# EAGLE design hawb-board (EAGLE 6.4)

## Sheet 1 of 2
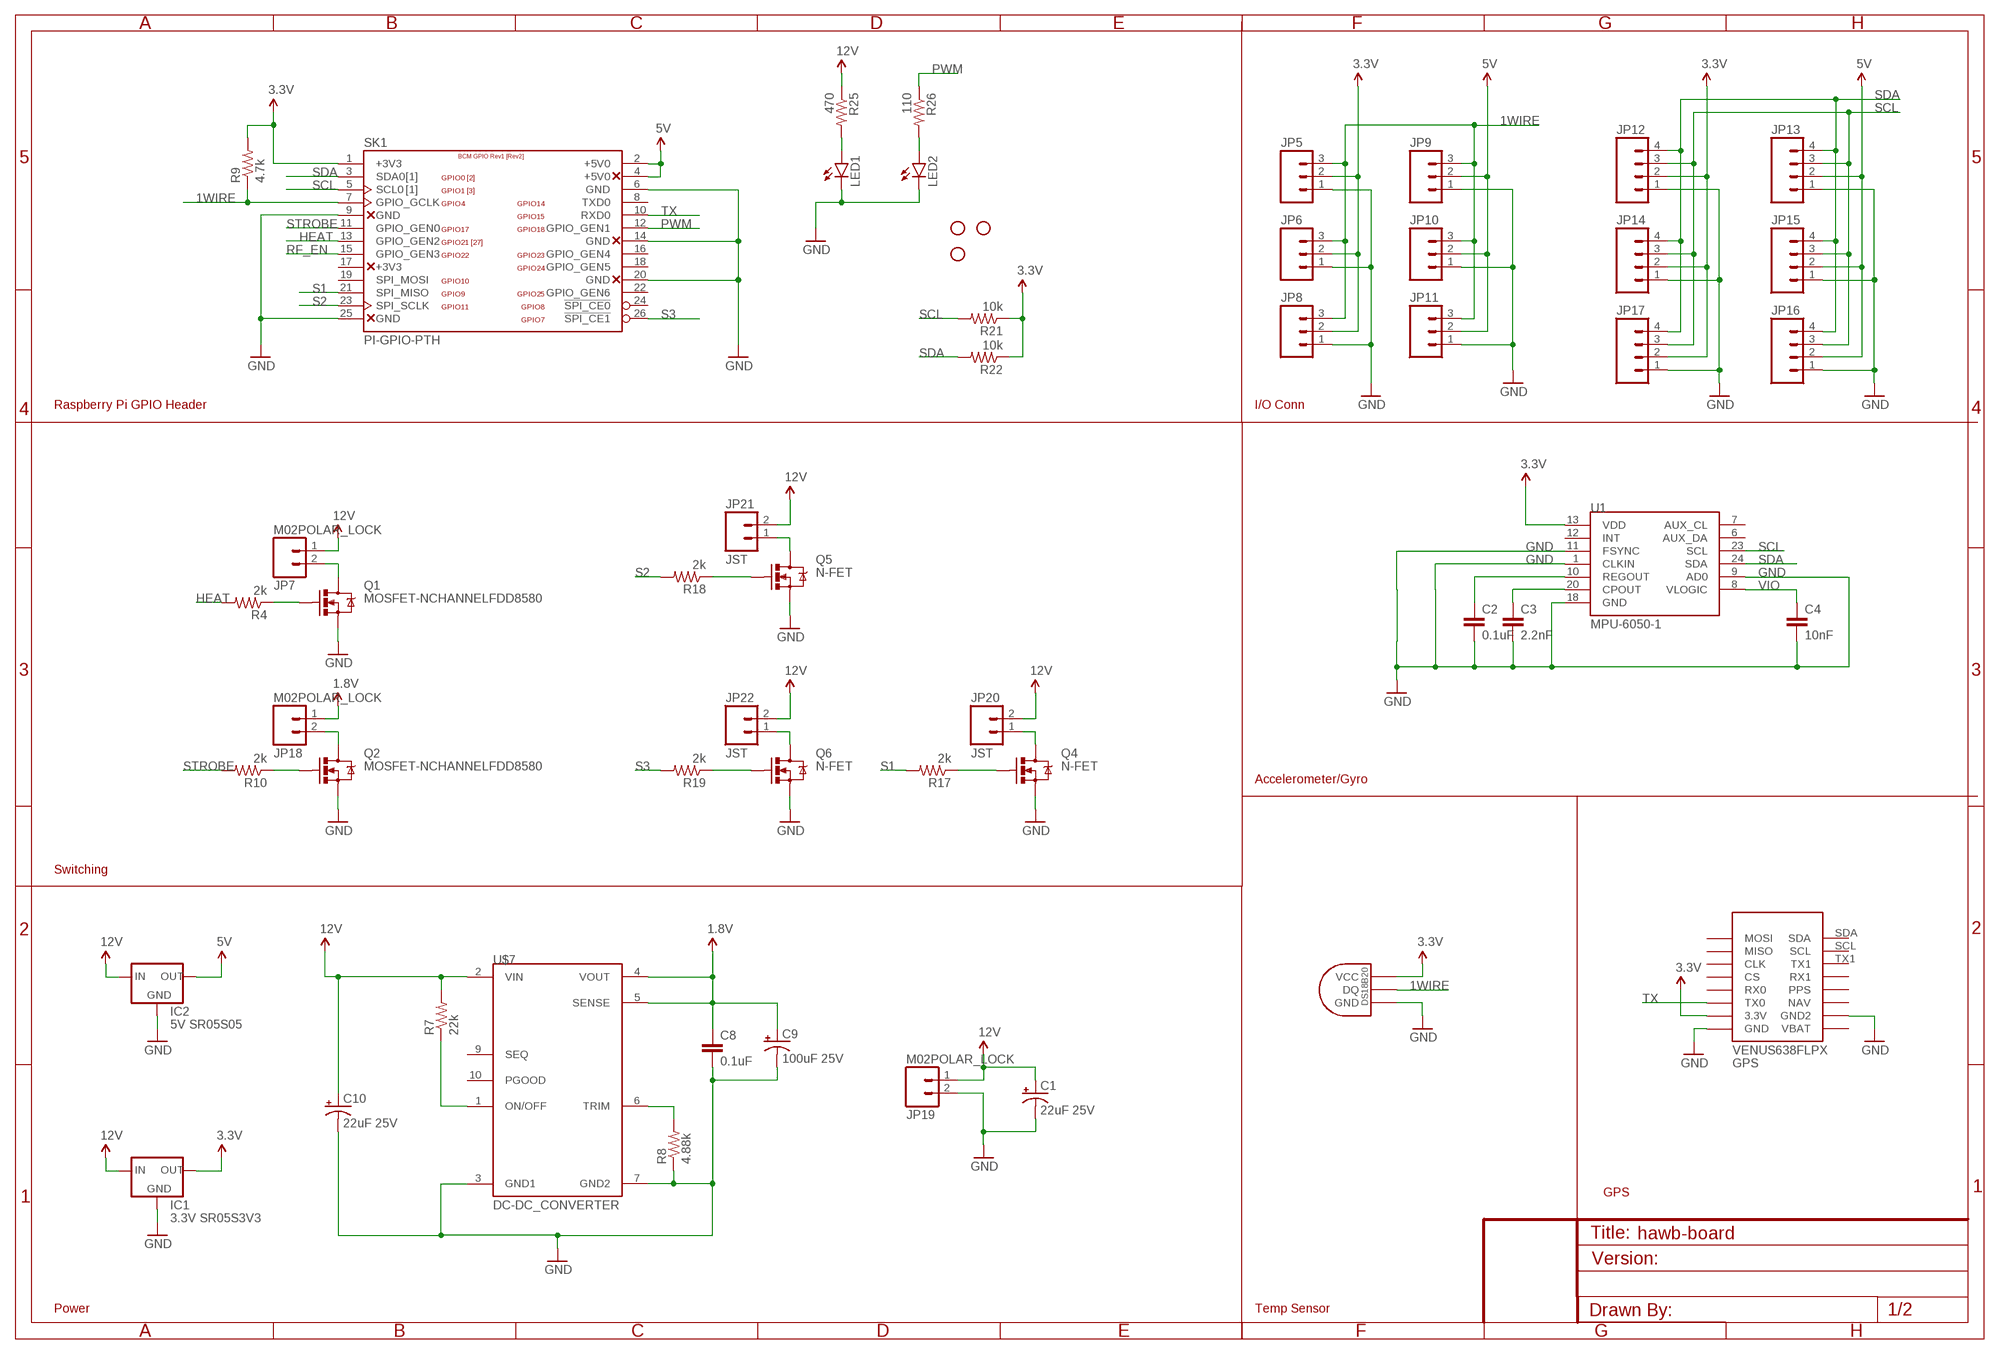
[diagram p0: schematic, sheet 1]

### Parts
C1  22uF 25V  CAP_POLC  [PANASONIC_C]
C2  0.1uF  CAP0402-CAP  [0402-CAP]
C3  2.2nF  CAP0402-CAP  [0402-CAP]
C4  10nF  CAP0402-CAP  [0402-CAP]
C8  0.1uF  C-EUC0603  [C0603]
C9  100uF 25V  CAP_POLF80  [NIPPON_F80]
C10  22uF 25V  CAP_POLC  [PANASONIC_C]
GPS  VENUS638FLPX  [VENUS638FLPX]
IC1  3.3V SR05S3V3  78XXS  [78XXS]
IC2  5V SR05S05  78XXS  [78XXS]
JP1  STAND-OFF  [STAND-OFF]
JP2  STAND-OFF  [STAND-OFF]
JP4  STAND-OFF  [STAND-OFF]
JP5  M03JST-PTH-VERT  [JST-3-PTH-VERT]
JP6  M03JST-PTH-VERT  [JST-3-PTH-VERT]
JP7  M02POLAR_LOCK  [MOLEX-1X2_LOCK]
JP8  M03JST-PTH-VERT  [JST-3-PTH-VERT]
JP9  M03JST-PTH-VERT  [JST-3-PTH-VERT]
JP10  M03JST-PTH-VERT  [JST-3-PTH-VERT]
JP11  M03JST-PTH-VERT  [JST-3-PTH-VERT]
JP12  M04JST-PTH-VERT  [JST-4-PTH-VERT]
JP13  M04JST-PTH-VERT  [JST-4-PTH-VERT]
JP14  M04JST-PTH-VERT  [JST-4-PTH-VERT]
JP15  M04JST-PTH-VERT  [JST-4-PTH-VERT]
JP16  M04JST-PTH-VERT  [JST-4-PTH-VERT]
JP17  M04JST-PTH-VERT  [JST-4-PTH-VERT]
JP18  M02POLAR_LOCK  [MOLEX-1X2_LOCK]
JP19  M02POLAR_LOCK  [MOLEX-1X2_LOCK]
JP20  JST  M02JST-PTH-VERT  [JST-2-PTH-VERT]
JP21  JST  M02JST-PTH-VERT  [JST-2-PTH-VERT]
JP22  JST  M02JST-PTH-VERT  [JST-2-PTH-VERT]
LED1  LED1206  [LED-1206]
LED2  LED1206  [LED-1206]
Q1  MOSFET-NCHANNELFDD8580  [DPAK]
Q2  MOSFET-NCHANNELFDD8580  [DPAK]
Q4  N-FET  MOSFET-NCHANNELSMD  [SOT23-3]
Q5  N-FET  MOSFET-NCHANNELSMD  [SOT23-3]
Q6  N-FET  MOSFET-NCHANNELSMD  [SOT23-3]
R4  2k  RESISTOR0603-RES  [0603-RES]
R7  22k  RESISTOR0603-RES  [0603-RES]
R8  4.88k  RESISTOR0603-RES  [0603-RES]
R9  4.7k  RESISTOR0603-RES  [0603-RES]
R10  2k  RESISTOR0603-RES  [0603-RES]
R17  2k  RESISTOR0603-RES  [0603-RES]
R18  2k  RESISTOR0603-RES  [0603-RES]
R19  2k  RESISTOR0603-RES  [0603-RES]
R21  10k  RESISTOR0603-RES  [0603-RES]
R22  10k  RESISTOR0603-RES  [0603-RES]
R25  470  RESISTOR0603-RES  [0603-RES]
R26  110  RESISTOR0603-RES  [0603-RES]
SK1  PI-GPIO-PTH  [GPIO-CONNECTOR]
U1  MPU-6050-1  [QFN-24-4MM2]
U$4  DS1820SOIC  [DS18B20_SOIC]
U$7  DC-DC_CONVERTER  [DC-DC_CONVERTER]

### Nets
1.8V: C8.1 C9.+ JP18.1 U$7.4(VOUT) U$7.5(SENSE)
1WIRE: JP5.3 JP6.3 JP8.3 JP9.3 JP10.3 JP11.3 R9.1 SK1.7(GPIO_GCLK) U$4.DQ
3.3V: GPS.3.3V IC1.OUT JP5.2 JP6.2 JP8.2 JP12.2 JP14.2 JP17.2 R9.2 R21.1 R22.1 SK1.1(+3V3) U1.13(VDD) U$4.VCC ; also sheet 2
5V: IC2.OUT JP9.2 JP10.2 JP11.2 JP13.2 JP15.2 JP16.2 SK1.2(+5V0) SK1.4(+5V0) ; also sheet 2
GND: C1.- C2.2 C3.2 C4.2 C8.2 C9.- C10.- GPS.GND GPS.GND2 IC1.GND IC2.GND JP5.1 JP6.1 JP8.1 JP9.1 JP10.1 JP11.1 JP12.1 JP13.1 JP14.1 JP15.1 JP16.1 JP17.1 JP19.2 LED1.C LED2.C Q1.3(S) Q2.3(S) Q4.2(S) Q5.2(S) Q6.2(S) R8.1 SK1.6(GND) SK1.9(GND) SK1.14(GND) SK1.20(GND) SK1.25(GND) U1.1(CLKIN) U1.9(AD0) U1.11(FSYNC) U1.18(GND) U$4.GND U$7.3(GND1) U$7.7(GND2) ; also sheet 2
HEAT: R4.2 SK1.13(GPIO_GEN2)
N$3: JP7.2 Q1.4(D)
N$5: C3.1 U1.20(CPOUT)
N$6: Q1.1(G) R4.1
N$7: R8.2 U$7.6(TRIM)
N$8: R7.1 U$7.1(ON/OFF)
N$9: C2.1 U1.10(REGOUT)
N$10: JP18.2 Q2.4(D)
N$12: Q2.1(G) R10.1
N$15: JP20.1 Q4.3(D)
N$19: Q4.1(G) R17.1
N$21: JP21.1 Q5.3(D)
N$22: Q5.1(G) R18.1
N$23: JP22.1 Q6.3(D)
N$24: Q6.1(G) R19.1
N$27: LED1.A R25.2
N$28: LED2.A R26.2
PWM: R26.1 SK1.12(GPIO_GEN1)
RF_EN: SK1.15(GPIO_GEN3) ; also sheet 2
S1: R17.2 SK1.21(SPI_MISO)
S2: R18.2 SK1.23(SPI_SCLK)
S3: R19.2 SK1.26(!SPI_CE1)
SCL: JP12.3 JP13.3 JP14.3 JP15.3 JP16.3 JP17.3 R21.2 SK1.5(SCL0) U1.23(SCL) ; also sheet 2
SDA: JP12.4 JP13.4 JP14.4 JP15.4 JP16.4 JP17.4 R22.2 SK1.3(SDA0) U1.24(SDA) ; also sheet 2
STROBE: R10.2 SK1.11(GPIO_GEN0)
TX: GPS.TX0 SK1.10(RXD0)
VCC: C1.+ C10.+ IC1.IN IC2.IN JP7.1 JP19.1 JP20.2 JP21.2 JP22.2 R7.2 R25.1 U$7.2(VIN) ; supply symbol labelled 12V ; also sheet 2
VIO: C4.1 U1.8(VLOGIC)
Unconnected: GPS.CLK GPS.CS GPS.MISO GPS.MOSI GPS.NAV GPS.PPS GPS.RX0 GPS.RX1 GPS.SCL GPS.SDA GPS.TX1 GPS.VBAT SK1.8(TXD0) SK1.16(GPIO_GEN4) SK1.17(+3V3) SK1.18(GPIO_GEN5) SK1.19(SPI_MOSI) SK1.22(GPIO_GEN6) SK1.24(!SPI_CE0) U1.6(AUX_DA) U1.7(AUX_CL) U1.12(INT) U$7.9(SEQ) U$7.10(PGOOD)

### Notes on the sheet
- Raspberry Pi GPIO Header | I/O Conn
- Accelerometer/Gyro
- Switching
- GPS
- Power | Temp Sensor

## Sheet 2 of 2
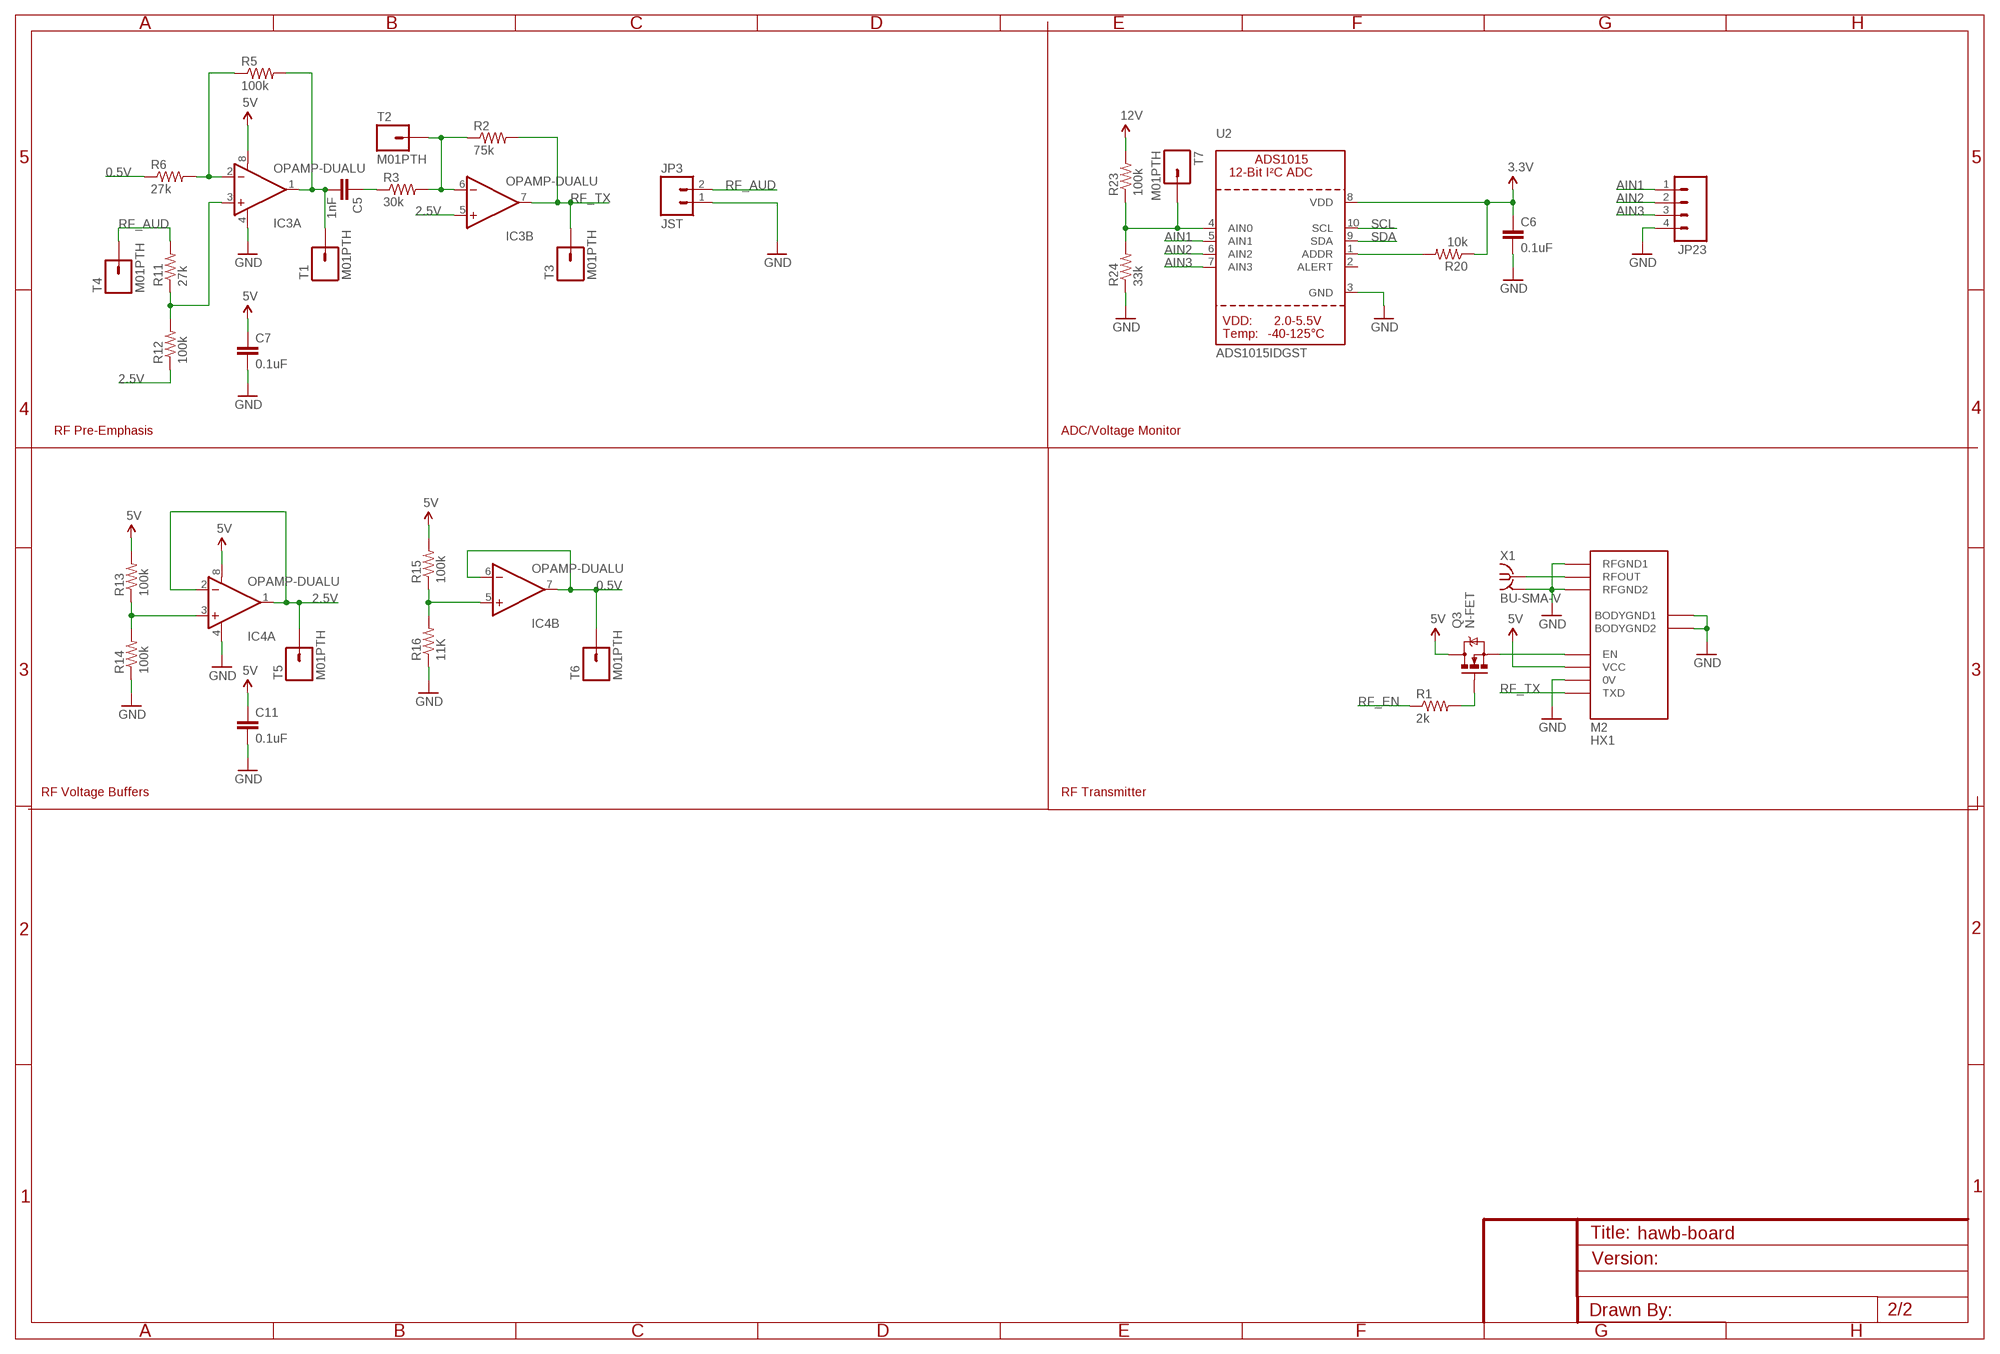
[diagram p1: schematic, sheet 2]

### Parts
C5  1nF  CAP0603-CAP  [0603-CAP]
C6  0.1uF  C-EUC0603  [C0603]
C7  0.1uF  C-EUC0603  [C0603]
C11  0.1uF  C-EUC0603  [C0603]
IC3  OPAMP-DUALU  [SO08]
IC4  OPAMP-DUALU  [SO08]
JP3  JST  M02JST-PTH-VERT  [JST-2-PTH-VERT]
JP23  M04JST-PTH-VERT  [JST-4-PTH-VERT]
M2  HX1  [HX1]
Q3  N-FET  MOSFET-NCHANNELSMD  [SOT23-3]
R1  2k  RESISTOR0603-RES  [0603-RES]
R2  75k  RESISTOR0603-RES  [0603-RES]
R3  30k  RESISTOR0603-RES  [0603-RES]
R5  100k  RESISTOR0603-RES  [0603-RES]
R6  27k  RESISTOR0603-RES  [0603-RES]
R11  27k  RESISTOR0603-RES  [0603-RES]
R12  100k  RESISTOR0603-RES  [0603-RES]
R13  100k  RESISTOR0603-RES  [0603-RES]
R14  100k  RESISTOR0603-RES  [0603-RES]
R15  100k  RESISTOR0603-RES  [0603-RES]
R16  11K  RESISTOR0603-RES  [0603-RES]
R20  10k  RESISTOR0603-RES  [0603-RES]
R23  100k  RESISTOR0603-RES  [0603-RES]
R24  33k  RESISTOR0603-RES  [0603-RES]
T1  M01PTH  [1X01]
T2  M01PTH  [1X01]
T3  M01PTH  [1X01]
T4  M01PTH  [1X01]
T5  M01PTH  [1X01]
T6  M01PTH  [1X01]
T7  M01PTH  [1X01]
U2  ADS1015IDGST  ADC_ADS1015  [MSOP10]
X1  BU-SMA-V  [BU-SMA-V]

### Nets
0.5V: IC4.6(B:-IN) IC4.7(B:OUT) R6.1 T6.1
2.5V: IC3.5(B:+IN) IC4.1(A:OUT) IC4.2(A:-IN) R12.1 T5.1
3.3V: C6.1 R20.1 U2.8(VDD) ; also sheet 1
5V: C7.1 C11.1 IC3.8(A:V+) IC4.8(A:V+) M2.VCC Q3.3(D) R13.2 R15.2 ; also sheet 1
AIN1: JP23.1 U2.5(AIN1)
AIN2: JP23.2 U2.6(AIN2)
AIN3: JP23.3 U2.7(AIN3)
GND: C6.2 C7.2 C11.2 IC3.4(A:V-) IC4.4(A:V-) JP3.1 JP23.4 M2.0V M2.BODYGND1 M2.BODYGND2 M2.RFGND1 M2.RFGND2 R14.1 R16.1 R24.1 U2.3(GND) X1.2(GND) ; also sheet 1
N$1: M2.EN Q3.2(S)
N$2: Q3.1(G) R1.2
N$4: M2.RFOUT X1.1
N$11: IC3.2(A:-IN) R5.1 R6.2
N$13: IC3.3(A:+IN) R11.1 R12.2
N$14: C5.1 R3.1
N$16: C5.2 IC3.1(A:OUT) R5.2 T1.1
N$17: IC3.6(B:-IN) R2.1 R3.2 T2.1
N$18: IC4.3(A:+IN) R13.1 R14.2
N$20: IC4.5(B:+IN) R15.1 R16.2
N$25: R20.2 U2.1(ADDR)
N$26: R23.1 R24.2 T7.1 U2.4(AIN0)
RF_AUD: JP3.2 R11.2 T4.1
RF_EN: R1.1 ; also sheet 1
RF_TX: IC3.7(B:OUT) M2.TXD R2.2 T3.1
SCL: U2.10(SCL) ; also sheet 1
SDA: U2.9(SDA) ; also sheet 1
VCC: R23.2 ; supply symbol labelled 12V ; also sheet 1
Unconnected: U2.2(ALERT)

### Notes on the sheet
- RF Pre-Emphasis | ADC/Voltage Monitor
- RF Voltage Buffers | RF Transmitter

## Power pins joined to a net without a drawn wire
GND: X1.3(GND) X1.4(GND) X1.5(GND)

## Library data of the parts
C1 C10 = sparkfun:CAP_POL: Capacitor Polarized These are standard SMD and PTH capacitors. Normally 10uF, 47uF, and 100uF in electrolytic and tantalum varieties. Always verify the external diameter of the through hole cap, it varies with capacity, voltage, and manufacturer. The EIA devices should be standard.
C2-C4 = sparkfun:CAP: Capacitor Standard 0603 ceramic capacitor, and 0.1" leaded capacitor.
C5 = SparkFun-Capacitors:CAP: Capacitor Standard 0603 ceramic capacitor, and 0.1" leaded capacitor.
C6-C8 C11 = rcl:C-EU: CAPACITOR, European symbol
C9 = SparkFun-Passives:CAP_POL: Capacitor Polarized These are standard SMD and PTH capacitors. Normally 10uF, 47uF, and 100uF in electrolytic and tantalum varieties. Always verify the external diameter of the through hole cap, it varies with capacity, voltage, and manufacturer. The EIA devices should be standard.
GPS = trackuino:VENUS638FLPX
IC1 IC2 = v-reg:78XXS: VOLTAGE REGULATOR
IC3 IC4 = sparkfun:OPAMP-DUAL: Operational Amplifier
JP1 JP2 JP4 = sparkfun:STAND-OFF: Stand Off This is the mechanical footprint for a #4 phillips button head screw. Use the keepout ring to avoid running the screw head into surrounding components. SKU : PRT-00447
JP3 JP7 JP18-JP22 = SparkFun-Connectors:M02: Standard 2-pin 0.1" header. Use with - straight break away headers ( PRT-00116) - right angle break away headers (PRT-00553) - swiss pins (PRT-00743) - machine pins (PRT-00117) - female headers (PRT-00115) Molex polarized connector foot print use with: PRT-08233 with associated crimp pins and housings. 2.54_SCREWTERM for use with PRT-10571. 3.5mm Screw Terminal footprints for PRT-08084 5mm Screw Terminal footprints for use with PRT-08433
JP5 JP6 JP8-JP11 = SparkFun-Connectors:M03: Header 3 Standard 3-pin 0.1" header. Use with straight break away headers (SKU : PRT-00116), right angle break away headers (PRT-00553), swiss pins (PRT-00743), machine pins (PRT-00117), and female headers (PRT-00115). Molex polarized connector foot print use with SKU : PRT-08232 with associated crimp pins and housings.
JP12-JP17 JP23 = SparkFun-Connectors:M04: Header 4 Standard 4-pin 0.1" header. Use with straight break away headers (SKU : PRT-00116), right angle break away headers (PRT-00553), swiss pins (PRT-00743), machine pins (PRT-00117), and female headers (PRT-00115). Molex polarized connector foot print use with SKU : PRT-08231 with associated crimp pins and housings. 1MM SMD Version SKU: PRT-10208
LED1 LED2 = SparkFun-LED:LED: LEDs Standard schematic elements and footprints for 5mm, 3mm, 1206, and 0603 sized LEDs. 5mm - Spark Fun Electronics SKU : COM-00529 (and others)
M2 = trackuino:HX1
Q1-Q6 = sparkfun:MOSFET-NCHANNEL
R1-R26 = sparkfun:RESISTOR: Resistor Basic schematic elements and footprints for 0603, 1206, and PTH resistors.
SK1 = jt-raspberry-pi:PI-: Raspberry Pi
T1-T7 = SparkFun-Connectors:M01: Header 1 Standard 1-pin 0.1" header. Use with straight break away headers (SKU : PRT-00116), right angle break away headers (PRT-00553), swiss pins (PRT-00743), machine pins (PRT-00117), and female headers (PRT-00115).
U1 = Testing:MPU-6050
U2 = microbuilder:ADC_ADS1015: ADS1015 - 12-bit 4-Channel I2C ADC with Internal PGA VDD: 2.0-5.5V Sampling Rate: 3.3ksps Gain Settings: 2/3, 1, 2, 4, 8, 16 I2C Address: ADDR low = 1001000x, ADDR high = 1001001x Internal Comparator The ADS1015 includes an internal comparator that can be set to output a high-level on ALERT when the conversion results exceeeds a pre-defined upper level, and will deassert itself when the level falls below a pre-defined lower threshold level. It can also be set to windowed mode where the ALERT pin will be asserted if the data exceeds the upper threshold or falls below the lower threshold.
U$4 = Ava:DS1820: DS18B20 Programmable Resolution 1-Wire Digital Thermometer Description The DS18B20 digital thermometer provides 9-bit to 12-bit Celsius temperature measurements and has an alarm function with nonvolatile user-programmable upper and lower trigger points. The DS18B20 communicates over a 1-Wire® bus that by definition requires only one data line (and ground) for communication with a central microprocessor. It has an operating temperature range of -55°C to +125°C and is accurate to ±0.5°C over the range of -10°C to +85°C. In addition, the DS18B20 can derive power directly from the data line ("parasite power"), eliminating the need for an external power supply. Each DS18B20 has a unique 64-bit serial code, which allows multiple DS18B20s to function on the same 1-Wire bus. Thus, it is simple to use one microprocessor to control many DS18B20s distributed over a large area. Applications that can benefit from this feature include HVAC environmental controls, temperature monitoring systems inside buildings, equipment, or machinery, and process monitoring and control systems.
U$7 = sparkfun:DC-DC_CONVERTER
X1 = con-coax:BU-SMA-V: FEMALE SMA CONNECTOR Radiall distributor RS 112-3794; OC_FARNELL: unknown; OC_NEWARK: unknown

## Net classes
2 20: width 0.508 mm

## Board
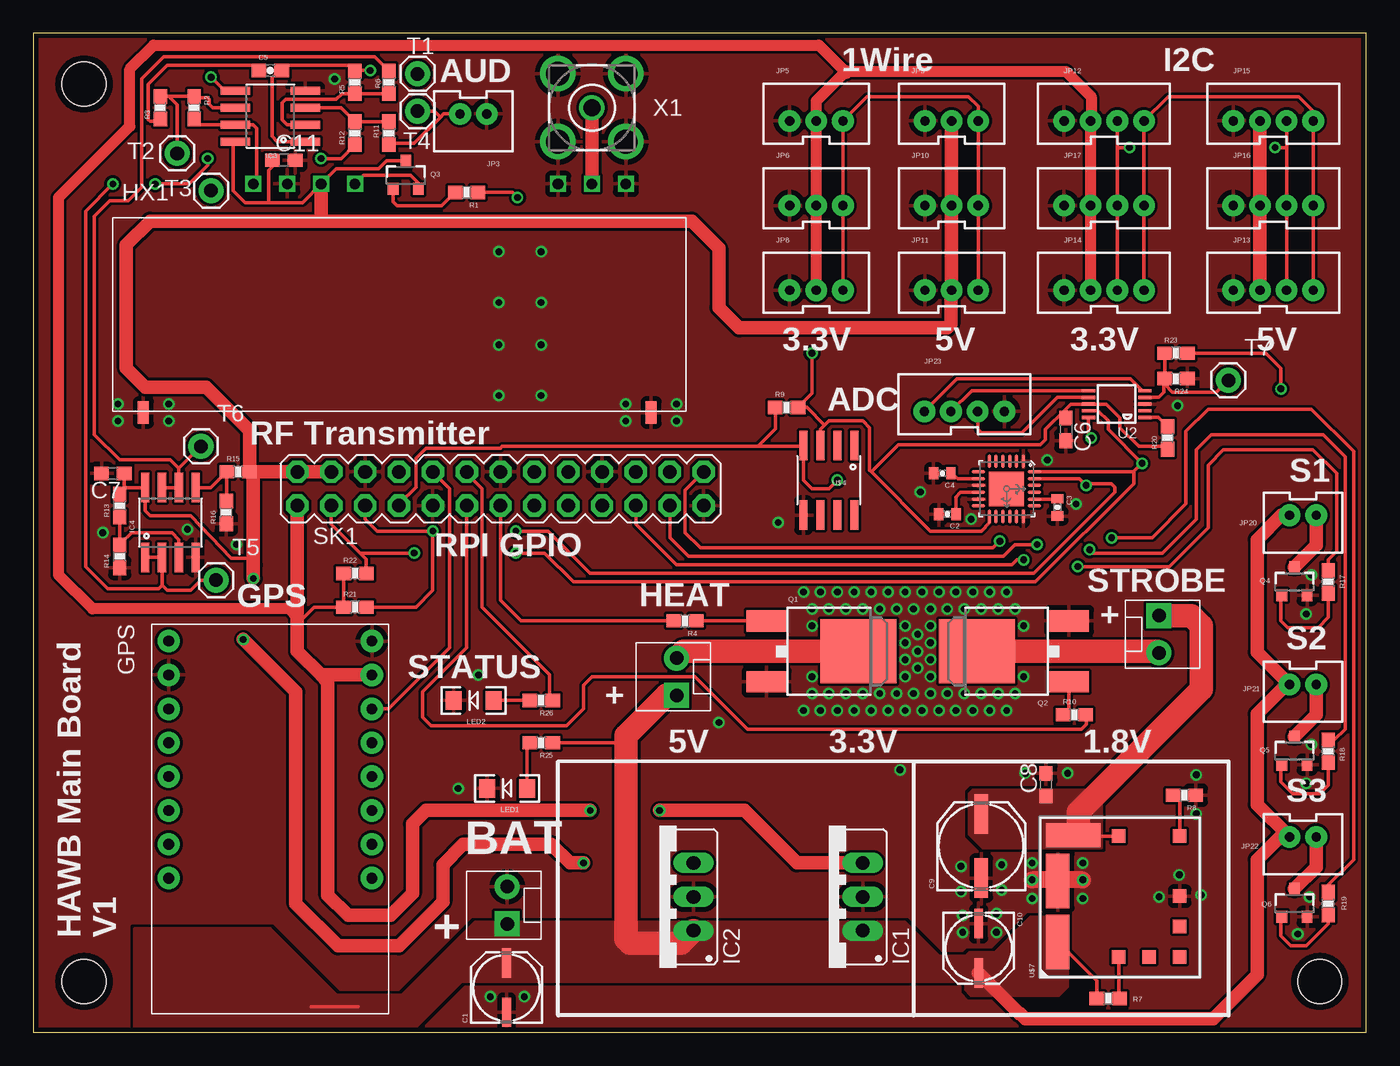
[diagram p2: board, top side]
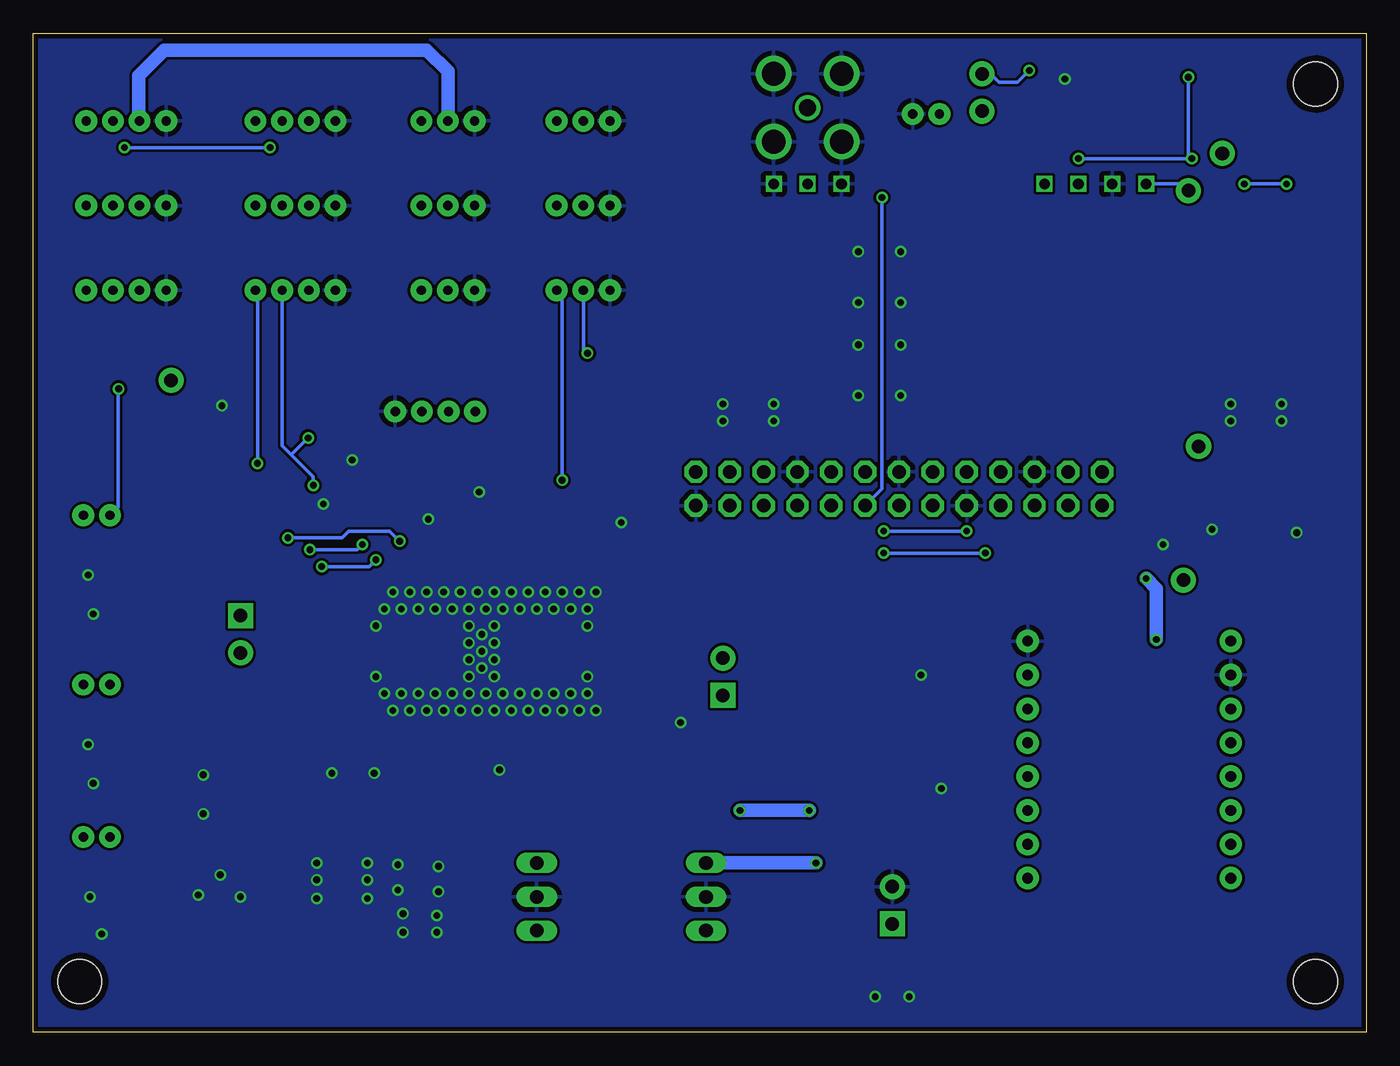
[diagram p3: board, bottom side, seen from below]

Size 100 x 74.92 mm. Coordinates in mm from the lower left corner, seen from the top.
Outline: 0,0 100,0 100,74.92 0,74.92 0,0
Copper layers (1*16): Top 0.0356mm / dielectric 1.5011mm / Bottom 0.0356mm
Design rules "LaenPCBOrder *": minimum track width 6mil, minimum drill 13mil, track to track 6mil, track to pad 6mil, pad to pad 6mil, via to via 6mil, smd to smd 6mil, copper to edge 15mil, drill to drill 6mil, minimum pad ring 7mil, minimum via ring 7mil, stop-mask expansion 4mil, vias tented up to drill 25mil, thermal gap 15mil

### Footprints (pad centres in the part's own frame; a part is rotated, then mirrored left to right if it is on the bottom)
PANASONIC_C = smd 2.2 x 0.65: + 1.9,-0.2; - -1.8,-0.2
0402-CAP = smd 0.7 x 0.9: 1 -0.65,0; 2 0.65,0
0603-CAP = smd 1.1 x 1: 1 -0.85,0; 2 0.85,0
C0603 = smd 1.1 x 1: 1 -0.85,0; 2 0.85,0
NIPPON_F80 = smd 2.95 x 1: + 2.4,0; - -2.4,0
VENUS638FLPX = drill 0.8 pad 1.676: 3.3V 3.81,16.51; CLK 13.97,16.51; CS 11.43,16.51; GND 1.27,16.51; GND2 3.81,1.27; MISO 16.51,16.51; MOSI 19.05,16.51; NAV 6.35,1.27; PPS 8.89,1.27; RX0 8.89,16.51; RX1 11.43,1.27; SCL 16.51,1.27; SDA 19.05,1.27; TX0 6.35,16.51; TX1 13.97,1.27; VBAT 1.27,1.27
78XXS = drill 1.016 long: GND 0,-2.54; IN -2.54,-2.54; OUT 2.54,-2.54
SO08 = smd 0.61 x 2.21: 1 -1.905,-2.616; 2 -0.635,-2.616; 3 0.635,-2.616; 4 1.905,-2.616; 5 1.905,2.616; 6 0.635,2.616; 7 -0.635,2.616; 8 -1.905,2.616
STAND-OFF = hole 3.302: 0,0
JST-2-PTH-VERT = drill 0.7 pad 1.626: 1 -1,-0.55; 2 1,-0.55
JST-3-PTH-VERT = drill 0.7 pad 1.626: 1 -2,-0.55; 2 0,-0.55; 3 2,-0.55
MOLEX-1X2_LOCK = drill 1.016 pad 1.88 square: 1 -0.127,0 | drill 1.016 pad 1.88: 2 2.667,0
JST-4-PTH-VERT = drill 0.7 pad 1.626: 1 -3,-0.55; 2 -1,-0.55; 3 1,-0.55; 4 3,-0.55
LED-1206 = smd 1.2 x 1.4: A -1.5,0; C 1.5,0
HX1 = drill 0.8 square: 0V 25.4,-8.89; EN 20.32,-8.89; RFGND1 0,-8.89; RFGND2 5.08,-8.89; RFOUT 2.54,-8.89; TXD 27.94,-8.89; VCC 22.86,-8.89 | smd 0.813 x 1.676: BODYGND1 -1.905,8.255; BODYGND2 36.195,8.255
DPAK = smd 1.6 x 3: 1 -2.28,-5.31; 3 2.28,-5.31 | smd 4.826 x 5.715: 4 0,1.588
SOT23-3 = smd 0.8 x 0.9: 1 -0.95,-1; 2 0.95,-1; 3 0,1.1
0603-RES = smd 1.1 x 1: 1 -0.85,0; 2 0.85,0
GPIO-CONNECTOR = drill 1.016 pad 1.676 octagon: 1 -15.24,-1.27; 2 -15.24,1.27; 3 -12.7,-1.27; 4 -12.7,1.27; 5 -10.16,-1.27; 6 -10.16,1.27; 7 -7.62,-1.27; 8 -7.62,1.27; 9 -5.08,-1.27; 10 -5.08,1.27; 11 -2.54,-1.27; 12 -2.54,1.27; 13 0,-1.27; 14 0,1.27; 15 2.54,-1.27; 16 2.54,1.27; 17 5.08,-1.27; 18 5.08,1.27; 19 7.62,-1.27; 20 7.62,1.27; 21 10.16,-1.27; 22 10.16,1.27; 23 12.7,-1.27; 24 12.7,1.27; 25 15.24,-1.27; 26 15.24,1.27
1X01 = drill 1.016 pad 1.88: 1 0,0
QFN-24-4MM2 = smd 1.016 x 0.254: 1 -2.066,1.257; 2 -2.066,0.75; 3 -2.066,0.247; 4 -2.066,-0.287; 5 -2.066,-0.792; 6 -2.066,-1.297; 13 2.086,-1.297; 14 2.086,-0.792; 15 2.086,-0.287; 16 2.086,0.247; 17 2.086,0.75; 18 2.086,1.257 | smd 0.254 x 1.016: 7 -1.267,-2.122; 8 -0.762,-2.122; 9 -0.258,-2.122; 10 0.278,-2.122; 11 0.78,-2.122; 12 1.287,-2.122; 19 1.287,2.082; 20 0.78,2.082; 21 0.278,2.082; 22 -0.258,2.082; 23 -0.762,2.082; 24 -1.267,2.082 | smd 2.616 x 2.616: P$1 0.02,-0.01
MSOP10 = smd 0.25 x 1: 1 -1,-2.113; 2 -0.5,-2.113; 3 0,-2.113; 4 0.5,-2.113; 5 1,-2.113; 6 1,2.113; 7 0.5,2.113; 8 0,2.113; 9 -0.5,2.113; 10 -1,2.113
DS18B20_SOIC = smd 0.61 x 2.21: DQ 1.905,-2.616; GND 1.905,2.616; NC -1.905,-2.616; NC2 -0.635,-2.616; NC3 -1.905,2.616; NC4 -0.635,2.616; NC5 0.635,2.616; VCC 0.635,-2.616
DC-DC_CONVERTER = smd 1.01 x 1.01: 1 -4.48,0.1; 5 4.61,0.1; 6 4.61,-4.48; 7 0.1,-4.48; 8 -2.19,-4.48; 9 -4.48,-4.48; 10 -4.48,-2.19 | smd 4.07 x 1.77: 2 -3.33,4.67; 3 1.24,4.67 | smd 1.77 x 4.07: 4 4.67,3.53
BU-SMA-V = drill 1.27: 1 0,0 | drill 1.778: 2 -2.55,2.55; 3 2.55,2.55; 4 2.55,-2.55; 5 -2.55,-2.55

### Placement (x,y rotation side)
C1  35.31,3.3 90 top
C2  68.58,38.86 180 top
C3  76.83,39.37 270 top
C4  68.2,41.91 180 top
C5  17.78,72.14 0 top
C6  77.47,45.21 270 top
C7  5.97,41.91 180 top
C8  75.97,18.57 90 top
C9  71.12,13.97 90 top
C10  71.12,6.35 270 top
C11  18.8,65.41 0 top
GPS  8.89,30.61 270 top
IC1  59.69,10.16 90 top
IC2  46.99,10.16 90 top
IC3  17.78,68.71 90 top
IC4  10.29,38.23 0 top
JP1  3.81,71.12 0 top
JP2  3.81,3.81 0 top
JP3  33.02,68.33 180 top
JP4  96.52,3.81 0 top
JP5  58.74,68.9 0 top
JP6  58.74,62.55 0 top
JP7  48.26,25.4 90 top
JP8  58.74,56.2 0 top
JP9  68.9,68.9 0 top
JP10  68.9,62.55 0 top
JP11  68.9,56.2 0 top
JP12  80.33,68.9 0 top
JP13  93.03,56.2 0 top
JP14  80.33,56.2 0 top
JP15  93.03,68.9 0 top
JP16  93.03,62.55 0 top
JP17  80.33,62.55 0 top
JP18  84.45,31.11 270 top
JP19  35.56,8.26 90 top
JP20  95.25,38.23 180 top
JP21  95.25,25.53 180 top
JP22  95.25,14.1 180 top
JP23  69.85,47.12 0 top
LED1  35.56,18.29 180 top
LED2  33.02,24.89 180 top
M2  44.45,54.74 180 top
Q1  60.33,28.57 270 top
Q2  72.39,28.57 90 top
Q3  27.94,64.26 0 top
Q4  94.61,33.78 0 top
Q5  94.61,21.08 0 top
Q6  94.61,9.65 0 top
R1  32.51,62.99 180 top
R2  12.06,69.34 270 top
R3  9.53,69.34 90 top
R4  48.9,30.86 180 top
R5  24.13,71.25 90 top
R6  26.67,71.25 270 top
R7  80.64,2.54 180 top
R8  86.36,17.78 180 top
R9  56.52,46.86 0 top
R10  78.11,23.81 0 top
R11  26.67,67.44 270 top
R12  24.13,67.44 90 top
R13  6.48,39.5 90 top
R14  6.48,35.69 90 top
R15  15.37,42.04 0 top
R16  14.48,38.99 90 top
R17  97.16,33.78 90 top
R18  97.16,21.08 90 top
R19  97.16,9.65 90 top
R20  85.09,44.58 90 top
R21  24.13,31.88 0 top
R22  24.13,34.42 0 top
R23  85.72,50.93 0 top
R24  85.72,49.02 180 top
R25  38.1,21.72 180 top
R26  38.1,24.89 180 top
SK1  35.05,40.77 0 top
T1  28.83,71.88 0 top
T2  10.79,65.91 0 top
T3  13.34,63.12 0 top
T4  28.83,69.09 0 top
T5  13.72,33.91 0 top
T6  12.57,43.94 0 top
T7  89.66,48.9 0 top
U1  73.03,40.77 270 top
U2  81.28,47.12 90 top
U$4  59.69,41.4 180 top
U$7  81.53,10.11 90 top
X1  41.91,69.34 0 top

### Tracks (layer width: path | path; a pad name or v marks a point on that pad's centre or on a via)
0.5V
  Top 0.254: IC4.7 IC4.6 10.92,42.29 | 10.92,42.29 10.29,42.93 6.48,42.93 4.57,44.83 4.57,61.21 5.71,62.36 7.11,62.36 8.13,63.37 8.13,71.5 9.78,73.15 25.61,73.15 R6.1 | T6.1 10.92,42.29
1.8V
  Top 0.254: U$7.5 78.06,14.72 U$7.4 | 87.97,30.82 87.63,30.48
  Top 1.778: JP18.1 86.87,31.24 87.63,30.48 87.63,25.72 78.42,16.51 78.42,15.2 U$7.4
  pour Top (isolate 0.254, no thermals): 80.14,13.84 80.14,17.4 79.38,18.16 70.48,18.16 70.23,17.91 70.23,14.86 71.25,13.84
1WIRE  (via drill 0.51)
  Top 0.254: JP11.3 JP10.3 JP9.3 70.9,69.44 70.17,70.17 62.56,70.17 JP5.3 JP6.3 JP8.3 | v60.33,41.4 59.69,40.77 58.42,40.77 57.78,41.4 U$4.DQ 57.71,43.94 54.36,43.94 | SK1.7 27.43,39.62 28.7,40.89 28.7,43.05 29.46,43.82 35.05,43.82 35.18,43.94 54.36,43.94 | R9.1 55.66,45.25 54.36,43.94
  Bottom 0.254: v60.33,41.4 60.33,55.23 JP8.3
2.5V  (via drill 0.51)
  Top 0.254: IC4.1 IC4.2 9.65,33.53 | 9.65,33.53 9.4,33.27 5.59,33.27 3.94,34.93 3.94,61.6 v5.97,63.63 | IC3.5 14.35,70.61 v13.34,71.63 | v13.08,65.53 13.08,65.02 11.68,63.63 v9.14,63.63 | T5.1 12.57,33.91 11.81,33.15 10.03,33.15 9.65,33.53 | v21.59,65.53 23.07,65.53 R12.1
  Bottom 0.254: v13.34,71.63 13.34,65.79 v13.08,65.53 v21.59,65.53 | v9.14,63.63 v5.97,63.63
3.3V  (via drill 0.51)
  Top 0.254: U1.13 71.73,38.2 71.12,37.59 67.31,37.59 62.87,42.04 | 62.87,42.04 62.74,42.16 62.74,45.34 62.23,45.85 59.69,45.85 59.37,45.53 | 59.37,45.53 59.05,45.21 U$4.VCC | 59.37,45.53 58.04,46.86 R9.2 58.42,47.92 v58.42,50.93 | 19.81,30.61 21.08,31.88 R21.1 R22.1 | 77.47,46.74 77.85,47.12 U2.8 | 77.47,46.74 C6.1 | U2.8 80.52,47.12 81.53,46.1 81.53,45.34 82.93,43.94 84.88,43.94 R20.1 | U2.8 80.39,47.12 | 77.47,46.74 75.95,45.21 75.95,44.45 75.56,44.07 64.9,44.07 62.87,42.04
  Top 0.813: 60.93,72.04 58.93,74.04 9.02,74.04 7.24,72.26 7.24,67.94 1.91,62.61 1.91,34.29 4.45,31.75 19.18,31.75 19.81,31.11 | JP14.2 JP17.2 JP12.2 | JP8.2 JP6.2 JP5.2 58.74,69.85 60.93,72.04 | 60.93,72.04 60.96,72.07 77.47,72.07 79.38,70.17 79.38,68.39
  Top 1.016: 79.38,68.39 JP12.2 | SK1.1 19.81,31.11 19.81,30.61 19.81,28.57 21.59,26.8 | 21.59,26.8 GPS.3.3V | IC1.OUT 57.28,12.7 53.34,16.64 v46.99,16.64 | 21.59,26.8 22.1,26.29 22.1,10.29 23.62,8.76 26.8,8.76 28.45,10.41 28.45,15.62 29.46,16.64 v41.78,16.64 | 60.96,72.01 60.93,72.04
  Bottom 0.254: JP8.2 58.74,51.24 v58.42,50.93
  Bottom 1.016: v41.78,16.64 v46.99,16.64
5V  (via drill 0.51)
  Top 0.254: 6.97,40.84 IC4.8 8.38,39.12 8.76,38.73 11.81,38.73 14.86,35.56 16,35.56 16.51,35.05 | 6.97,40.84 R13.2 | 16.26,42 R15.2 | 17.65,62.23 20.19,62.23 M2.VCC 22.73,64.77 25.91,64.77 26.5,65.36 Q3.3 | 17.65,62.23 15.88,62.23 14.99,63.12 14.99,66.62 IC3.8 | C7.1 6.82,41 6.97,40.84 | C11.1 17.95,64.94 17.65,64.64 17.65,62.23
  Top 0.813: 16.51,41.74 R15.2
  Top 1.016: JP15.2 JP16.2 JP13.2 | JP9.2 JP10.2 JP11.2 68.83,55.58 68.83,53.09 68.58,52.83 52.96,52.83 51.44,54.36 51.44,58.8 49.4,60.83 21.59,60.83 | M2.VCC 21.59,60.83 | v41.27,12.7 40.26,12.7 38.86,14.1 32.26,14.1 30.73,12.57 30.73,9.78 27.43,6.48 22.86,6.48 19.68,9.65 19.68,25.53 v15.75,29.46 | v16.51,34.04 16.51,35.05 16.51,41.74 | 21.59,60.83 8.76,60.83 6.99,59.05 6.99,49.78 8.38,48.39 12.95,48.39 16.22,45.12 R15.2 SK1.2 SK1.4
  Bottom 1.016: JP9.2 68.9,72.07 70.48,73.66 90.17,73.66 92.08,71.75 92.08,68.39 JP15.2 | IC2.OUT v41.27,12.7 | v15.75,29.46 15.75,33.27 v16.51,34.04
AIN1
  Top 0.254: U2.5 83.2,48.12 82.3,49.02 69.31,49.02 JP23.1
AIN2
  Top 0.254: U2.6 70.4,48.12 JP23.2
AIN3
  Top 0.254: JP23.3 70.85,45.23 71.12,44.96 74.17,44.96 76.83,47.62 U2.7
GND  (via drill 0.51)
  Top 1.27: v78.74,11.43 v74.93,11.43
  other vias: 69.6,12.45 69.6,10.54 69.72,8.76 69.72,7.49 72.26,7.49 72.26,8.89 72.64,10.67 72.64,12.57 74.93,12.7 74.93,10.03 78.74,10.03 78.74,12.7 84.45,10.16 85.98,11.81 87.63,10.29 74.42,19.43 77.6,19.43 87.25,19.3 87.25,16.38 57.78,33.02 59.05,33.02 60.33,33.02 61.59,33.02 62.87,33.02 64.14,33.02 65.41,33.02 66.67,33.02 67.94,33.02 69.22,33.02 70.48,33.02 71.75,33.02 73.03,33.02 58.42,31.75 59.69,31.75 60.96,31.75 62.23,31.75 63.5,31.75 64.77,31.75 66.04,31.75 67.31,31.75 68.58,31.75 69.85,31.75 71.12,31.75 72.39,31.75 73.66,31.75 65.41,30.48 66.36,29.84 67.31,30.48 65.41,29.21 66.36,28.57 67.31,29.21 65.41,27.94 66.36,27.3 67.31,27.94 65.41,26.67 67.31,26.67 58.42,30.48 58.42,26.67 58.42,25.4 57.78,24.13 59.69,25.4 59.05,24.13 60.96,25.4 60.33,24.13 62.23,25.4 61.59,24.13 63.5,25.4 62.87,24.13 64.77,25.4 64.14,24.13 66.04,25.4 65.41,24.13 67.31,25.4 66.67,24.13 68.58,25.4 67.94,24.13 69.85,25.4 69.22,24.13 71.12,25.4 70.48,24.13 72.39,25.4 71.75,24.13 73.66,25.4 73.03,24.13 74.3,30.48 74.3,26.67 6.35,47.12 6.35,45.85 10.16,47.12 44.45,47.12 44.45,45.85 48.26,47.12 48.26,45.85 34.29,2.67 36.83,2.67 70.36,38.48 15.24,36.58 5.21,37.47 10.16,45.85 78.23,39.62 94.87,7.37 95.76,10.16 95.89,34.29 95.5,31.37 95.89,21.59 95.5,18.67 55.88,38.23 85.85,46.99 66.55,40.51 76.07,42.93 22.61,71.5 34.92,58.55 38.1,58.55 34.92,54.74 38.1,54.74 34.92,51.56 38.1,51.56 34.92,47.75 38.1,47.75 51.44,23.24 65.02,19.68 31.88,18.29 33.4,26.8 11.56,37.72
  pour Bottom (isolate 0.2): 100.33,74.93 0,74.93 0,0 100.33,0
  pour Top (isolate 0.2, rank 6): 100.33,74.93 0,74.93 0,0 100.33,0
HEAT
  Top 0.254: R4.2 36.58,30.86 35.05,32.39 SK1.13
N$1
  Top 0.254: Q3.2 28.89,63.69 28.32,64.26 24.77,64.26 M2.EN
N$2
  Top 0.254: Q3.1 26.99,62.29 27.3,61.98 30.65,61.98 R1.2
N$3
  Top 1.778: Q1.4 48.77,28.57 JP7.2
N$4
  Top 1.016: X1.1 M2.RFOUT
N$5
  Top 0.254: U1.20 76.8,39.99 C3.1
N$6
  Top 0.254: Q1.1 R4.1
N$7
  Top 0.254: U$7.6 86.01,17.28 R8.2
N$8
  Top 0.254: U$7.1 81.43,2.6 R7.1
N$9
  Top 0.254: U1.10 69.57,40.49 69.22,40.13 69.22,38.88 C2.1
N$10
  Top 1.778: Q2.4 84.33,28.57 JP18.2
N$11
  Top 0.254: R6.2 R5.1 23.15,70.4 22.73,69.98 18.92,69.98 18.67,69.72 18.67,68.45 19.05,68.07 IC3.2
N$12
  Top 0.254: Q2.1 77.7,24.26 R10.1
N$13
  Top 0.254: R11.1 R12.2 23.07,69.34 IC3.3
N$14
  Top 0.254: R3.1 9.36,68.33 8.76,68.33 8.64,68.45 8.64,71.12 10.03,72.52 16.75,72.52 C5.1
N$15
  Top 1.016: JP20.1 96.25,36.52 Q4.3
N$16  (via drill 0.51)
  Top 0.254: IC3.1 18.29,66.8 17.91,67.18 17.91,71.61 C5.2 18.81,72.52 23.71,72.52 R5.2 24.17,72.14 v25.27,72.14
  Bottom 0.254: T1.1 28.19,71.88 27.56,71.25 26.16,71.25 v25.27,72.14
N$17
  Top 0.254: IC3.6 13.46,69.34 13.21,69.6 13.21,69.98 13.08,70.1 12.15,70.1 R2.1 10.16,70.19 | 10.16,70.19 R3.2 | T2.1 10.79,69.56 10.16,70.19
N$18
  Top 0.254: R13.1 6.48,36.7 | R14.2 6.48,36.7 | 6.48,36.7 6.6,36.7 7.37,37.47 10.41,37.47 10.92,36.96 IC4.3
N$19
  Top 0.254: R17.1 97.16,31.11 96.39,30.35 94.11,30.35 93.6,30.86 93.6,32.72 Q4.1
N$20
  Top 0.254: IC4.5 13.32,40.84 R15.1 14.52,39.93 arc-45 R16.2
N$21
  Top 1.016: JP21.1 96.25,23.82 Q5.3
N$22
  Top 0.254: R18.1 97.16,18.54 96.52,17.91 94.49,17.91 93.6,18.8 93.6,20.02 Q5.1
N$23
  Top 1.016: JP22.1 96.25,12.39 Q6.3
N$24
  Top 0.254: R19.1 97.16,8.13 95.5,6.48 94.36,6.48 93.6,7.24 93.6,8.59 Q6.1
N$25
  Top 0.254: U2.1 84.4,46.12 R20.2
N$26
  Top 0.254: R23.1 R24.2 | U2.4 84.45,47.62 84.84,48.01 84.84,48.98 R24.2 | R24.2 84.88,48.6 85.47,48.01 88.77,48.01 T7.1
N$27
  Top 0.254: LED1.A 37.06,21.53 R25.2
N$28
  Top 0.254: R26.2 LED2.A
PWM
  Top 0.254: SK1.12 32.51,41.91 33.66,40.77 33.66,31.88 38.73,26.8 38.73,25.11 R26.1
RF_AUD
  Top 0.254: JP3.2 30.78,68.88 30.54,68.64 | 30.54,68.64 28.57,66.67 26.76,66.67 R11.2 | T4.1 30.1,69.09 30.54,68.64
RF_EN  (via drill 0.51)
  Top 0.254: 36.32,62.87 v36.32,62.61 35.94,62.99 R1.1
  Bottom 0.254: v36.32,62.61 36.32,40.77 SK1.15
RF_TX
  Top 0.254: R2.2 12.48,68.07 IC3.7 16.51,68.07 16.76,67.82 16.76,63.88 M2.TXD
  Bottom 0.254: M2.TXD 13.84,63.63 T3.1
S1  (via drill 0.51)
  Top 0.254: SK1.21 45.21,38.1 48.26,35.05 73.41,35.05 73.79,35.43 v74.3,35.43 | v78.36,34.93 85.22,34.93 88.14,37.85 88.14,42.55 89.28,43.69 96.01,43.69 97.79,41.91 97.79,36.07 97.16,35.43 R17.2
  Bottom 0.254: v78.36,34.93 74.8,34.93 v74.3,35.43
S2  (via drill 0.51)
  Top 0.254: R18.2 97.62,21.93 98.42,22.73 98.42,43.18 96.77,44.83 88.39,44.83 87.25,43.69 87.25,38.48 84.71,35.94 79.5,35.94 v79.25,36.2 | v75.31,36.58 73.66,36.58 72.77,35.69 49.15,35.69 47.75,37.08 SK1.23
  Bottom 0.254: v79.25,36.2 75.69,36.2 v75.31,36.58
S3  (via drill 0.51)
  Top 0.254: R19.2 97.16,11.05 99.06,12.95 99.06,43.56 95.89,46.74 88.14,46.74 86.49,45.09 86.49,39.62 83.95,37.08 v80.9,37.08 | SK1.26 48.9,40.64 48.9,37.47 50.04,36.32 72.01,36.32 v72.52,36.83
  Bottom 0.254: v80.9,37.08 76.83,37.08 76.33,37.59 73.28,37.59 v72.52,36.83
SCL  (via drill 0.51)
  Top 0.254: JP13.3 JP16.3 94.03,66.36 | 94.03,66.36 JP15.3 94.03,67.36 | JP14.3 JP17.3 81.33,66.36 | 81.33,66.36 JP12.3 | v82.23,66.36 81.33,66.36 | v93.15,66.36 94.03,66.36 | SK1.5 24.89,38.48 25.78,37.59 v29.97,37.59 29.97,33.15 28.7,31.88 R21.2 | v36.2,37.59 38.61,37.59 41.78,34.42 75.06,34.42 81.15,40.51 81.15,40.89 80.9,41.15 79.12,41.15 v78.99,41.02 78.49,41.53 U1.23 | U2.10 79.17,44.79 v79.38,44.58
  Bottom 0.254: v93.15,66.36 v82.23,66.36 | JP14.3 81.33,43.99 80.64,43.31 | v29.97,37.59 v36.2,37.59 | v78.99,41.02 78.99,41.66 80.64,43.31 | v79.38,44.58 80.64,43.31
SDA  (via drill 0.51)
  Top 0.254: JP13.4 JP16.4 JP15.4 96.03,69.07 94.93,70.17 85.15,70.17 JP12.4 JP17.4 JP14.4 | U1.24 82.55,42.03 | 82.55,42.03 v83.19,42.67 80.64,45.21 80.64,45.85 79.88,46.62 U2.9 | SK1.3 22.35,38.1 24.51,35.94 | 24.51,35.94 v28.57,35.94 | v36.2,35.94 38.35,35.94 40.51,33.78 75.18,33.78 82.55,41.15 82.55,42.03 | R22.2 24.98,35.47 24.51,35.94
  Bottom 0.254: v83.19,42.67 83.19,55.51 JP14.4 | v28.57,35.94 v36.2,35.94
STROBE
  Top 0.254: R10.2 78.99,23.77 78.99,23.11 78.61,22.73 53.59,22.73 49.66,26.67 41.91,26.67 41.27,26.04 41.27,24.26 40.01,22.99 29.84,22.99 29.21,23.62 29.21,25.53 32.51,28.83 SK1.11
TX
  Top 0.254: SK1.10 31.24,40.77 31.24,28.83 26.67,24.26 GPS.TX0
VCC  (via drill 0.51)
  Top 0.254: R7.2 79.8,3.85 U$7.2 | v93.6,48.26 93.6,49.78 92.46,50.93 R23.2 | 24.38,1.91 20.83,1.91 | R25.1 44.32,21.72 44.45,21.59
  Top 1.016: C10.+ 73.97,1.4 74.04,1.4 74.42,1.02 88.52,1.02 91.82,4.32 91.82,12.95 93.47,14.61 94.21,14.61 JP22.2 91.82,17.08 91.82,23.88 94.02,26.08 JP21.2 91.82,28.51 91.82,36.96 93.64,38.78 JP20.2
  Top 1.778: JP7.1 47.5,25.27 44.45,22.22 44.45,21.59 44.45,6.98 44.77,6.67 48.58,6.67 IC2.IN
  Bottom 0.254: v93.6,48.26 93.64,48.22 93.64,39.39 JP20.2
  pour Top (isolate 0.254, rank 2, no thermals): 70.23,5.97 72.14,5.97 74.8,8.64 77.6,8.64 77.6,3.43 76.96,2.79 70.36,2.79 69.98,3.17 69.98,5.71
  pour Top (no thermals): 33.66,8.26 65.41,8.26 67.94,5.71 70.48,5.71 70.48,3.81 34.92,3.81 33.66,5.08
  pour Top: 7.62,0.13 7.62,7.75 17.78,7.75 22.86,2.67 22.86,0.13
  pour Top: 36.58,3.81 32.13,3.81 28.32,0 22.86,0 22.73,0.13 22.73,2.67 22.86,2.79 27.69,2.79 33.15,8.26 34.29,8.26 34.29,5.59 34.67,5.21 35.31,5.21 36.7,3.81
VIO
  Top 0.254: U1.8 69.36,41.53 C4.1

### Text on the board
tPlace: 1Wire | I2C | AUD | 3.3V | 5V | 3.3V | 5V | ADC | RF Transmitter | S1 | RPI GPIO | STROBE | GPS | HEAT | + | S2 | STATUS | + | 5V | 3.3V | 1.8V | S3 | BAT | HAWB Main Board / V1 | +